# EAGLE design waterius-factory-2.0 (EAGLE 9.0.1)
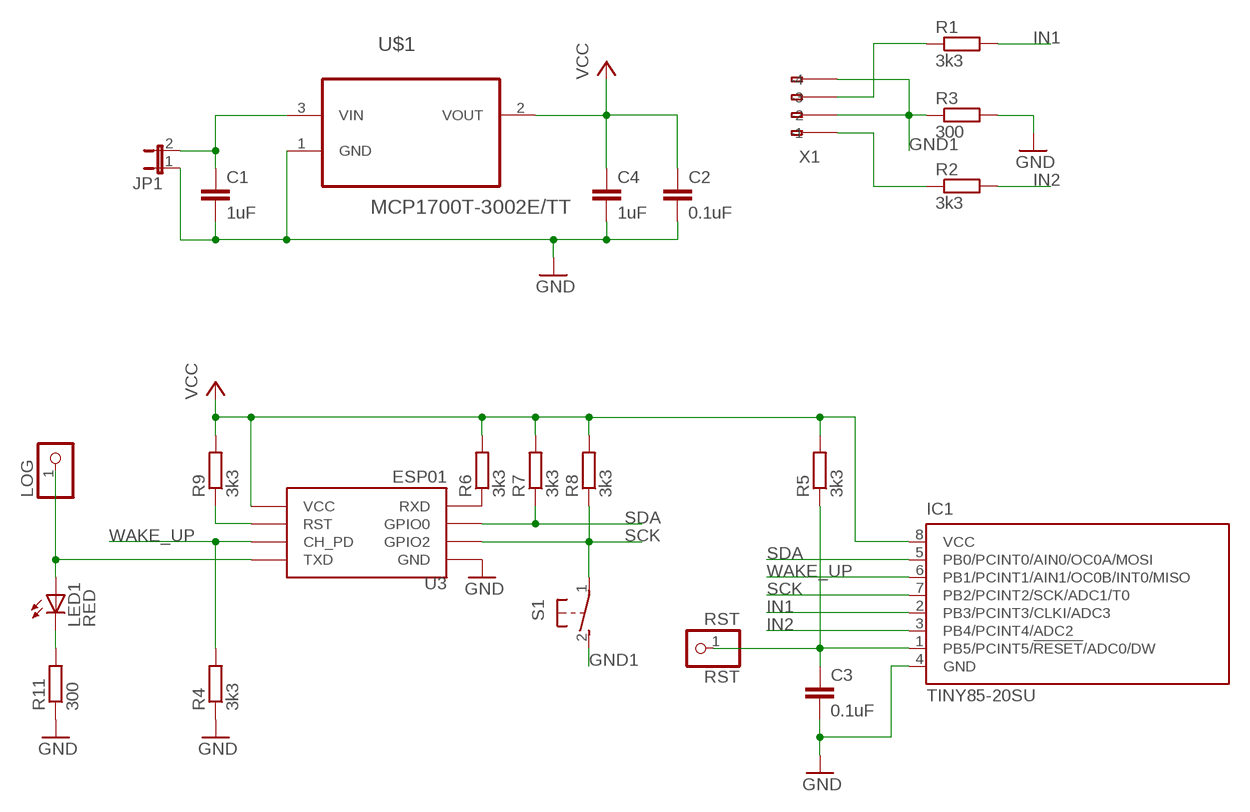
[diagram p0: schematic, sheet 1]

## Parts
C1  1uF  C-EUC0805  [C0805]
C2  0.1uF  C-EUC0805  [C0805]
C3  0.1uF  C-EUC0805  [C0805]
C4  1uF  C-EUC0805  [C0805]
IC1  TINY85-20SU  TINY13-20SU  [8S2]
JP1  JP1E  [JP1]
LED1  RED  LED3MM  [LED3MM]
LOG  PINHD-1X1  [1X01]
R1  3k3  R-EU_R0805  [R0805]
R2  3k3  R-EU_R0805  [R0805]
R3  300  R-EU_R0805  [R0805]
R4  3k3  R-EU_R0805  [R0805]
R5  3k3  R-EU_R0805  [R0805]
R6  3k3  R-EU_R0805  [R0805]
R7  3k3  R-EU_R0805  [R0805]
R8  3k3  R-EU_R0805  [R0805]
R9  3k3  R-EU_R0805  [R0805]
R11  300  R-EU_R0805  [R0805]
RST  RST  PINHD-1X1  [1X01]
S1  31-XX  [B3F-31XX]
U3  ESP01  [ESP01]
U$1  MCP1700T-3002E/TT  [SOT95P237X112-3N]
X1  233-104  [233-104]

## Nets
+3V: C2.1 C4.1 IC1.8(VCC) R5.2 R6.2 R7.2 R8.2 R9.2 U3.VCC U$1.2(VOUT) ; supply symbol labelled VCC
GND: C1.2 C2.2 C3.2 C4.2 IC1.4(GND) JP1.1 R3.2 R4.1 R11.1 U3.GND U$1.1(GND)
GND1: R3.1 S1.2(S) X1.A2(-2) X1.A4(-4)
IN1: IC1.2(PB3/PCINT3/CLKI/ADC3) R1.2
IN2: IC1.3(PB4/PCINT4/ADC2) R2.2
N$1: C1.1 JP1.2 U$1.3(VIN)
N$2: R6.1 U3.RX(RXD)
N$3: R9.1 U3.RST
N$4: C3.1 IC1.1(PB5/PCINT5/!RESET!/ADC0/DW) R5.1 RST.1
N$5: LED1.A LOG.1 U3.TX(TXD)
N$6: LED1.K(C) R11.2
N$7: R1.1 X1.A3(-3)
N$8: R2.1 X1.A1(-1)
SCK: IC1.7(PB2/PCINT2/SCK/ADC1/T0) R8.1 S1.1(P) U3.GPIO2
SDA: IC1.5(PB0/PCINT0/AIN0/OC0A/MOSI) R7.1 U3.GPIO0
WAKE_UP: IC1.6(PB1/PCINT1/AIN1/OC0B/INT0/MISO) R4.2 U3.CH_PD
Unconnected: X1.B1(B-1) X1.B2(B-2) X1.B3(B-3) X1.B4(B-4)

## Library data of the parts
C1-C4 = rcl:C-EU: CAPACITOR, European symbol; SPICEPREFIX: C
IC1 = atmel:TINY13: 8-bit AVR Microcontroller with 1K Bytes In-System Programmable Flash Source: http://www.atmel.com/dyn/resources/prod_documents/2535S.pdf; MPN: ATTINY13-20SU; OC_FARNELL: 9171568; OC_NEWARK: 96K6522
JP1 = jumper:JP1E: JUMPER
LED1 = led:LED: LED OSRAM: - CHIPLED LG R971, LG N971, LY N971, LG Q971, LY Q971, LO R971, LY R971 LH N974, LH R974 LS Q976, LO Q976, LY Q976 LO Q996 - Hyper CHIPLED LW Q18S LB Q993, LB Q99A, LB R99A - SideLED LS A670, LO A670, LY A670, LG A670, LP A670 LB A673, LV A673, LT A673, LW A673 LH A674 LY A675 LS A676, LA A676, LO A676, LY A676, LW A676 LS A679, LY A679, LG A679 - Hyper Micro SIDELED® LS Y876, LA Y876, LO Y876, LY Y876 LT Y87S - SmartLED LW L88C, LW L88S LB L89C, LB L89S, LG L890 LS L89K, LO L89K, LY L89K LS L896, LA L896, LO L896, LY L896 - TOPLED LS T670, LO T670, LY T670, LG T670, LP T670 LSG T670, LSP T670, LSY T670, LOP T670, LYG T670 LG T671, LOG T671, LSG T671 LB T673, LV T673, LT T673, LW T673 LH T674 LS T676, LA T676, LO T676, LY T676, LB T676, LH T676, LSB T676, LW T676 LB T67C, LV T67C, LT T67C, LS T67K, LO T67K, LY T67K, LW E67C LS E67B, LA E67B, LO E67B, LY E67B, LB E67C, LV E67C, LT E67C LW T67C LS T679, LY T679, LG T679 LS T770, LO T770, LY T770, LG T770, LP T770 LB T773, LV T773, LT T773, LW T773 LH T774 LS E675, LA E675, LY E675, LS T675 LS T776, LA T776, LO T776, LY T776, LB T776 LHGB T686 LT T68C, LB T68C - Hyper Mini TOPLED® LB M676 - Mini TOPLED Santana® LG M470 LS M47K, LO M47K, LY M47K Source: http://www.osram.convergy.de LUXEON: - LUMILED® LXK2-PW12-R00, LXK2-PW12-S00, LXK2-PW14-U00, LXK2-PW14-V00 LXK2-PM12-R00, LXK2-PM12-S00, LXK2-PM14-U00 LXK2-PE12-Q00, LXK2-PE12-R00, LXK2-PE12-S00, LXK2-PE14-T00, LXK2-PE14-U00 LXK2-PB12-K00, LXK2-PB12-L00, LXK2-PB12-M00, LXK2-PB14-N00, LXK2-PB14-P00, LXK2-PB14-Q00 LXK2-PR12-L00, LXK2-PR12-M00, LXK2-PR14-Q00, LXK2-PR14-R00 LXK2-PD12-Q00, LXK2-PD12-R00, LXK2-PD12-S00 LXK2-PH12-R00, LXK2-PH12-S00 LXK2-PL12-P00, LXK2-PL12-Q00, LXK2-PL12-R00 Source: www.luxeon.com KINGBRIGHT: KA-3528ASYC Source: www.kingbright.com
LOG RST = pinhead:PINHD-1X1: PIN HEADER
R1-R9 R11 = resistor:R-EU_: RESISTOR, European symbol
S1 = switch-omron:31-XX: OMRON SWITCH; MPN: B3F-3100; OC_FARNELL: 959704; OC_NEWARK: 36M3582
U3 = esp8266modules:ESP01: ESP8266 Wifi module 01
U$1 = MCP1700T-3002E_TT:MCP1700T-3002E/TT: Low Quiescent Current LDO; AVAILABILITY: Unavailable; DESCRIPTION: MCP1700 Series 250 mA 3 V Fixed Output LDO Voltage Regulator - SOT-23; MF: Microchip; MP: MCP1700T-3002E/TT; PACKAGE: SOT-23 Microchip; PRICE: None
X1 = con-wago255:233-104: WAGO; MPN: 233-104; OC_FARNELL: unknown; OC_NEWARK: 28K9046

## Net classes
0 default: clearance 0.205 mm

## Board
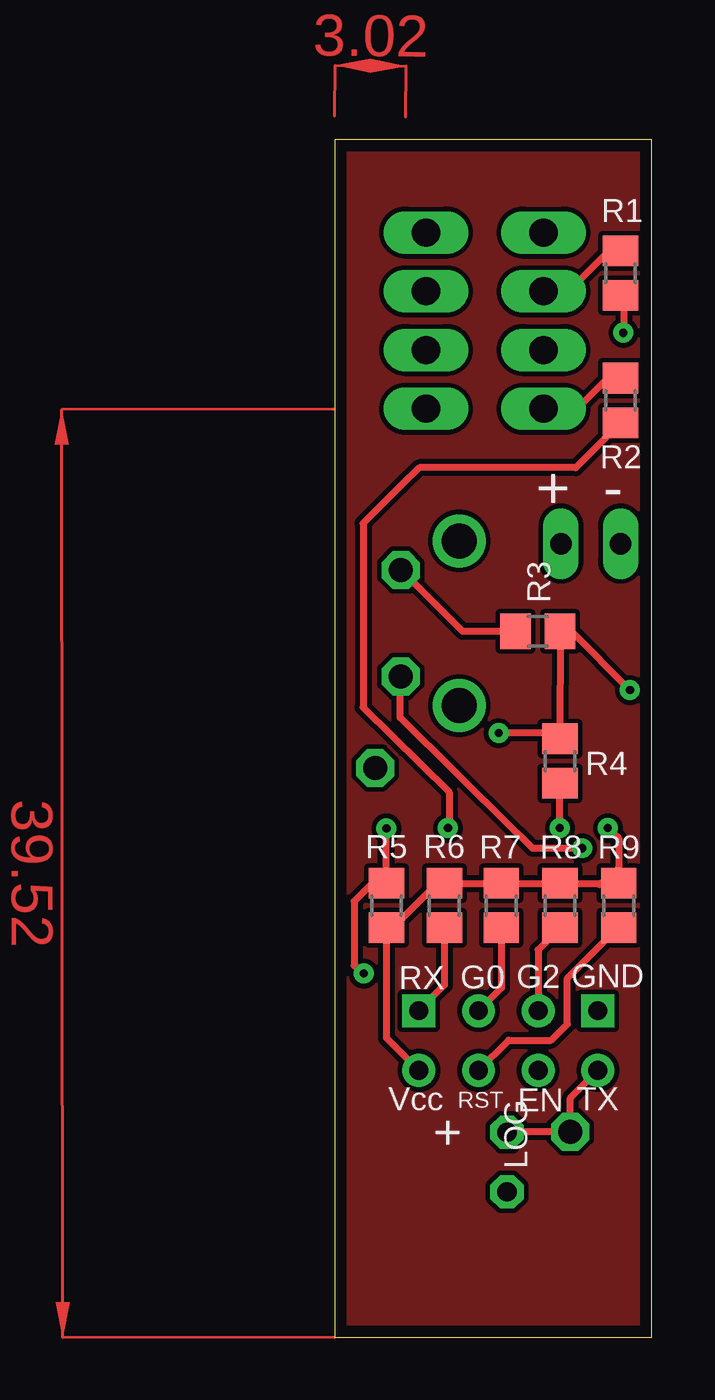
[diagram p1: board, top side]
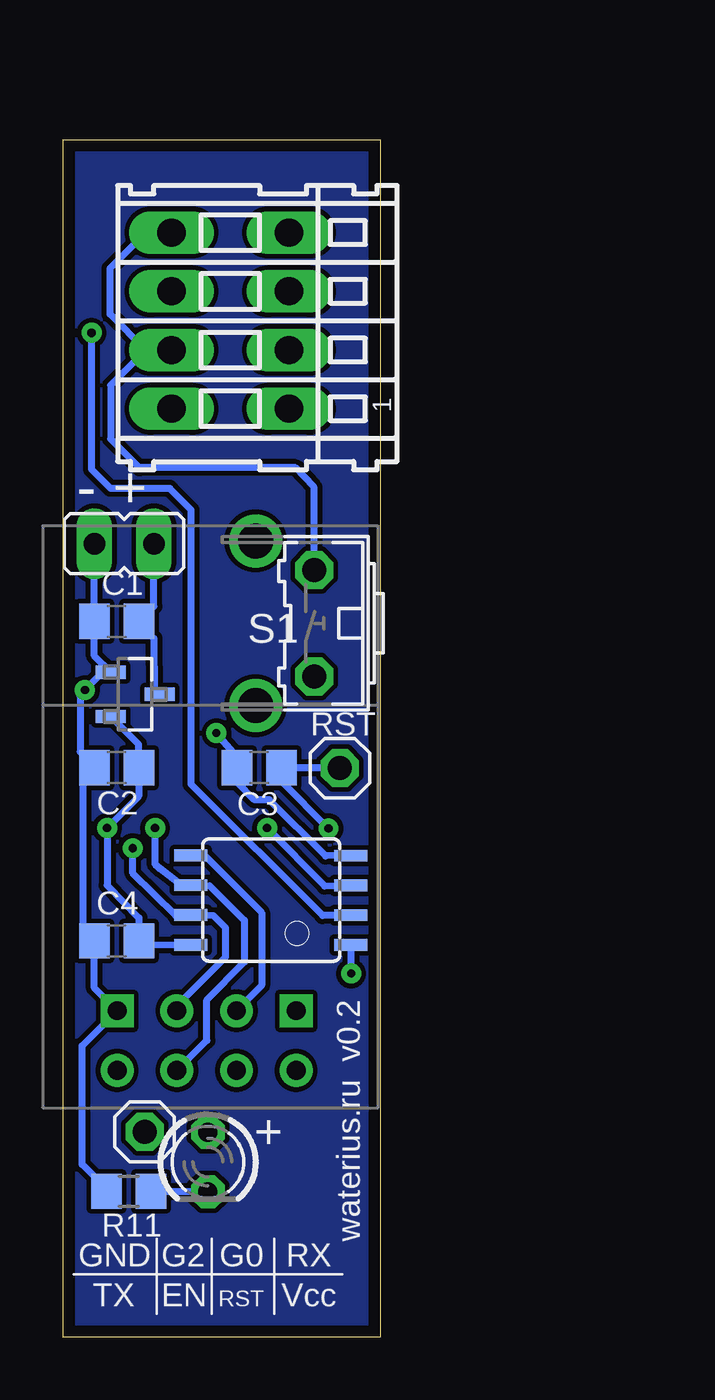
[diagram p2: board, bottom side, seen from below]

Size 13.5 x 51 mm. Coordinates in mm from the lower left corner, seen from the top.
Outline: 0,0 13.5,0 13.5,51 0,51 0,0
Copper layers (1*16): Top 0.035mm / dielectric 1.5mm / Bottom 0.035mm
Design rules "my *": minimum track width 0.25mm, minimum drill 0.3mm, track to track 0.2mm, track to pad 0.2mm, pad to pad 0.2mm, via to via 0.2mm, smd to smd 6mil, copper to edge 0.5mm, drill to drill 0.2mm, minimum pad ring 0.3mm, minimum via ring 0.25mm, stop-mask expansion 4mil, vias tented up to drill 0mil, thermal gap 10mil

### Footprints (pad centres in the part's own frame; a part is rotated, then mirrored left to right if it is on the bottom)
C0805 = smd 1.3 x 1.5: 1 -0.95,0; 2 0.95,0
8S2 = smd 0.5 x 1.4: 1 -1.905,-3.404; 2 -0.645,-3.404; 3 0.625,-3.404; 4 1.895,-3.404; 5 1.905,3.404; 6 0.635,3.404; 7 -0.635,3.404; 8 -1.905,3.404
JP1 = drill 0.914 long: 1 0,-1.27; 2 0,1.27
LED3MM = drill 0.813 octagon: A -1.27,0; K 1.27,0
1X01 = drill 1.016 octagon: 1 0,0
R0805 = smd 1.3 x 1.5: 1 -0.95,0; 2 0.95,0
B3F-31XX = drill 1.016 octagon: 1 -2.261,-1.245; 2 2.261,-1.245 | drill 1.499 pad 2.159: 3 -3.505,1.245; 4 3.505,1.245
ESP01 = drill 0.8: CH_PD -1.285,-8.178; GPIO0 1.255,-5.638; GPIO2 -1.285,-5.638; RST 1.255,-8.178; TX -3.825,-8.178; VCC 3.795,-8.178 | drill 0.8 square: GND -3.825,-5.638; RX 3.795,-5.638
SOT95P237X112-3N = smd 0.559 x 1.27: 1 -0.94,-1.041; 2 0.94,-1.041; 3 0,1.041
233-104 = drill 1.2 long: A1 -3.75,2.5; A2 -1.25,2.5; A3 1.25,2.5; A4 3.75,2.5; B1 -3.75,-2.5; B2 -1.25,-2.5; B3 1.25,-2.5; B4 3.75,-2.5

### Placement (x,y rotation side)
C1  11.23,30.49 180 bottom
C2  11.23,24.26 180 bottom
C3  5.15,24.26 180 bottom
C4  11.23,16.89 180 bottom
IC1  4.66,18.62 90 bottom
JP1  10.91,33.8 270 bottom
LED1  7.34,7.47 270 bottom
LOG  10.03,8.75 0 bottom
R1  12.17,45.31 270 top
R2  12.17,39.89 270 top
R3  8.65,30.07 0 top
R4  9.59,24.54 270 top
R5  2.21,18.39 270 top
R6  4.68,18.39 90 top
R7  7.1,18.39 90 top
R8  9.59,18.39 90 top
R9  12.09,18.39 90 top
R11  10.71,6.21 0 bottom
RST  1.73,24.24 0 bottom
S1  4.06,30.4 90 bottom
U3  7.38,19.55 0 bottom
U$1  10.44,27.38 270 bottom
X1  6.39,43.29 90 bottom

### Tracks (layer width: path | path; a pad name or v marks a point on that pad's centre or on a via)
+3V  (via drill 0.35)
  Top 0.305: R9.2 R7.2 R6.2 4.38,19.34 2.72,17.68 2.45,17.68 R5.2 2.21,12.74 U3.VCC | R9.2 11.27,19.27 R8.2 | R9.2 11.33,19.33 | v11.63,21.68 12.09,21.26 12.09,20.01 R9.2
  Bottom 0.305: U$1.2 10.3,25.26 C2.1 10.28,23.5 10.29,23.04 v11.63,21.68 11.63,19.25 10.28,17.87 C4.1 | IC1.8 9.93,16.69 C4.1 | 10.44,16.57 C4.1
GND  (via drill 0.35)
  Top 0.305: U3.GND | R4.1 9.38,25.73 v6.99,25.73 | R4.1 R3.2 10.06,30.1 v12.57,27.56 | 9.58,25.46 R4.1
  Bottom 0.305: U3.GND | IC1.4 2.33,20.49 4.72,22.89 5.36,22.89 6.1,23.63 C3.2 6.1,24.72 v6.99,25.73 | 12.19,31.09 12.19,30.4 C1.2 | C1.2 12.18,29.02 U$1.1 11.81,28.32 v12.57,27.56 12.78,27.3 12.78,24.93 C2.2 12.68,23.76 12.68,17.38 C4.2 12.18,14.88 U3.GND | R11.1 11.66,6.33 12.7,7.37 12.7,12.41 U3.GND | C1.2 JP1.1
GND1
  Top 0.305: R3.1 5.44,30.07 2.85,32.66 S1.2
  Bottom 0.305: 9.98,42.04 11.51,43.56 11.51,45.52 9.98,47.04 X1.A4 | X1.A2 9.98,42.04 | 9.98,42.04 11.48,40.54 11.48,38.25 10.26,37.03 3.61,37.03 2.85,36.22 2.82,36.2 S1.2
IN1  (via drill 0.35)
  Top 0.305: R1.2 12.32,44.27 v12.29,42.77
  Bottom 0.305: IC1.2 1.17,17.96 2.46,17.96 8.05,23.55 8.05,35.23 8.97,36.14 11.48,36.14 12.29,36.96 v12.29,42.77
IN2  (via drill 0.35)
  Top 0.305: R2.2 10.27,37.03 3.61,37.03 2.83,36.26 1.22,34.67 1.22,26.82 4.88,23.22 4.88,21.74 v4.83,21.68
  Bottom 0.305: v4.83,21.68 2.38,19.22 IC1.3
N$1
  Bottom 0.305: U$1.3 9.63,27.43 9.64,29.76 C1.1 9.64,31.12 JP1.2
N$2
  Top 0.305: R6.1 4.68,15 U3.RX
N$3
  Top 0.305: U3.RST 7.41,12.65 9.22,12.65 9.91,13.34 9.91,15.29 12.05,17.43 R9.1
N$4  (via drill 0.35)
  Top 0.305: v2.21,21.67 R5.1 1.61,19.34 0.84,18.57 0.84,15.82 v1.25,15.49
  Bottom 0.305: 1.04,16.71 IC1.1 1.26,15.48 v1.25,15.49 | v2.21,21.67 4.2,23.66 C3.1 4.18,24.24 RST.1
N$5
  Top 0.305: 10.79,10.96 U3.TX 10.04,10.2 LOG.1 7.36,8.75 LED1.A
N$6
  Bottom 0.305: LED1.K 9.61,6.19 R11.2
N$7
  Top 0.305: X1.A3 9.97,44.54 11.69,46.26 R1.1
N$8
  Top 0.305: X1.A1 10.33,39.54 11.66,40.87 R2.1
N$9
  pour Top: 0,0 13.5,0 13.5,51 0,51
N$11
  pour Bottom: 0,0 13.5,0 13.5,51 0,51
SCK  (via drill 0.35)
  Top 0.305: R8.1 8.67,16.51 U3.GPIO2 | v10.54,20.83 8.43,20.83 7.92,21.34 7.59,21.64 2.79,26.39 2.79,28.12 S1.1
  Bottom 0.305: U3.GPIO2 8.67,14.12 6.6,16.18 6.6,17.45 7.11,17.96 IC1.7 8.71,17.96 10.54,19.76 v10.54,20.83
SDA
  Top 0.305: R7.1 7.1,14.88 U3.GPIO0
  Bottom 0.305: IC1.5 7.44,20.47 | 7.44,20.47 5.05,18.09 5.05,14.98 U3.GPIO0 | 7.44,20.47 8.13,20.52
WAKE_UP  (via drill 0.35)
  Top 0.305: v9.59,21.68 R4.2
  Bottom 0.305: U3.CH_PD 7.39,12.64 7.39,14.38 5.79,15.98 5.79,17.75 7.26,19.23 IC1.6 8.43,19.23 9.4,19.96 9.58,20.12 v9.59,21.68
(copper drawn outside any net)
  shapes: Top area x2

### Text on the board
tNames: + - | RX | G0 | G2 | GND | Vcc | RST | EN | TX | +
bNames: - + | v0.2 | waterius.ru | + | RX | G0 | G2 | GND | Vcc | RST | EN | TX